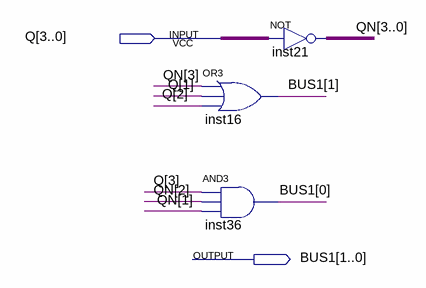
[diagram p0: schematic sheet]
// Quartus schematic bus1.bdf as structural Verilog: 3 symbols, 2 pins
module bus1 (
  input  [3:0] Q,
  output [1:0] BUS1
);

  wire [3:0] QN;

  or inst16 (BUS1[1], QN[3], Q[1], Q[2]);
  and inst36 (BUS1[0], Q[3], QN[2], QN[1]);
  assign QN = ~Q;  // NOT inst21, 4 bits wide
endmodule
